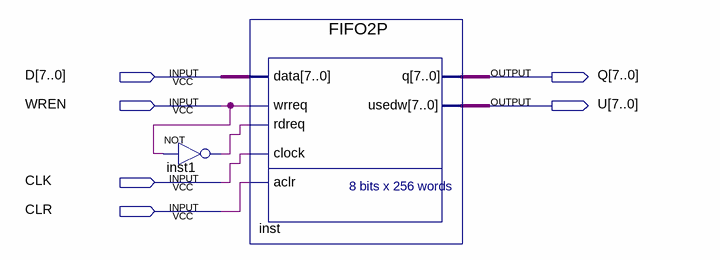
[diagram p0: schematic sheet]
// Quartus schematic FIFO.bdf as structural Verilog: 2 symbols, 6 pins
module FIFO (
  input  [7:0] D,
  input  WREN,
  input  CLK,
  input  CLR,
  output [7:0] Q,
  output [7:0] U
);

  wire inst1_out;

  not inst1 (inst1_out, WREN);
  FIFO2P inst (.data(D), .wrreq(WREN), .rdreq(inst1_out), .clock(CLK), .aclr(CLR), .q(Q), .usedw(U));
endmodule
